# EAGLE design bbhTiny85 (EAGLE 6.4)
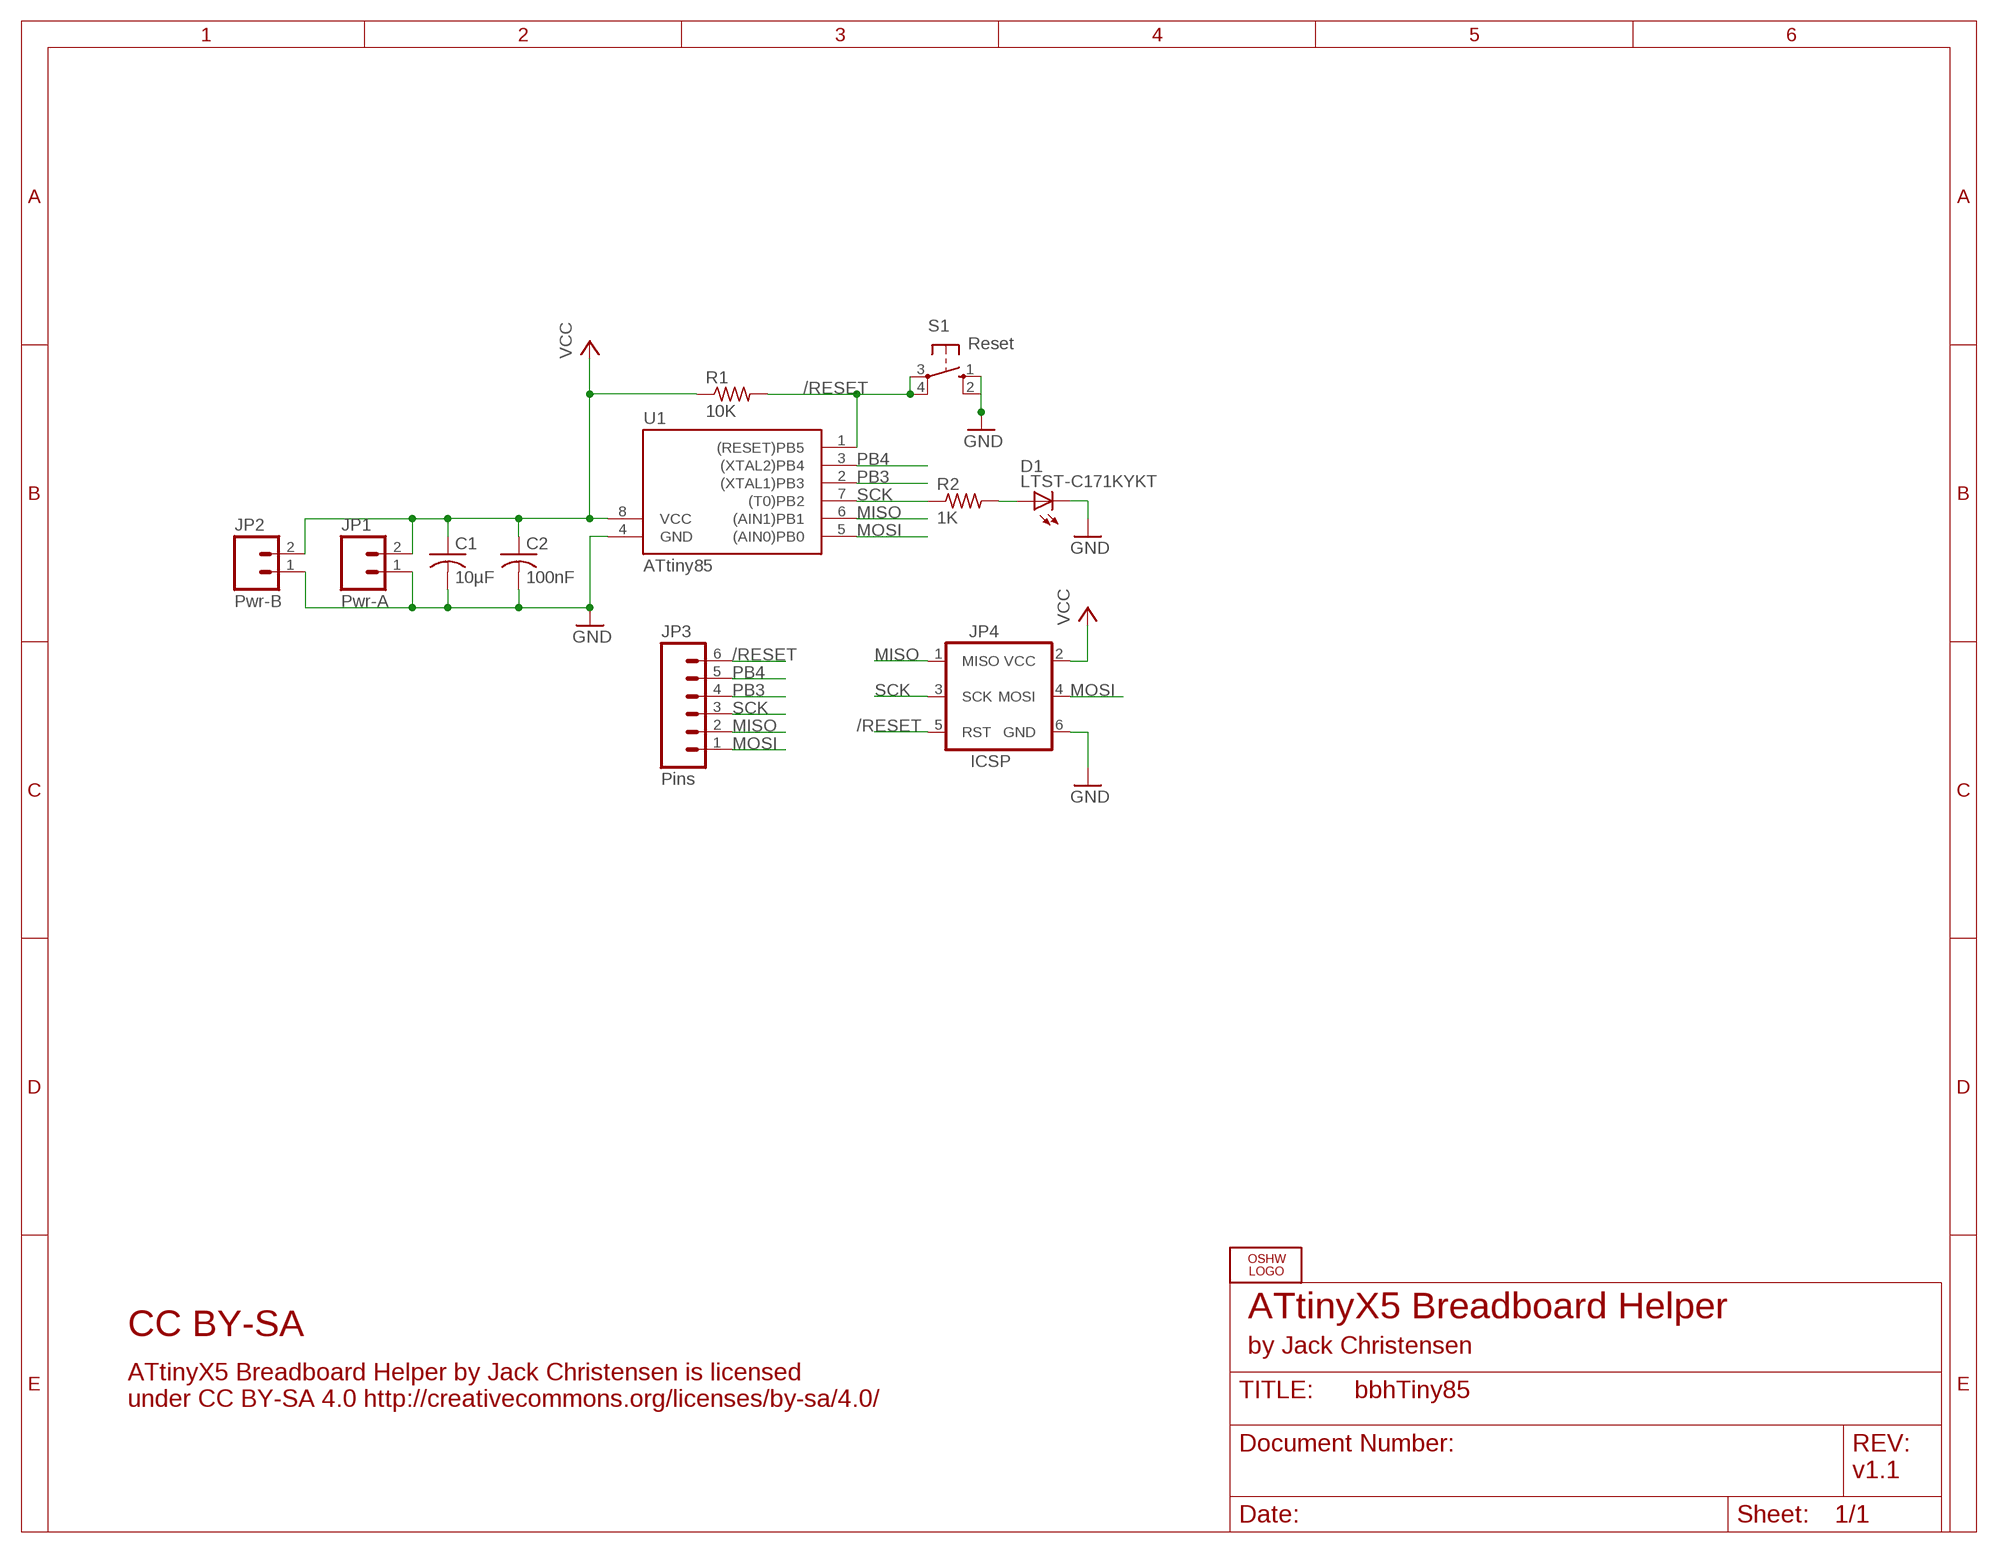
[diagram p0: schematic, sheet 1]

## Parts
C1  10µF  C-USM0805  [M0805]
C2  100nF  C-USM0805  [M0805]
D1  LTST-C171KYKT  LEDD0805A  [D0805A]
JP1  Pwr-A  M02PTH  [1X02]
JP2  Pwr-B  M02PTH  [1X02]
JP3  Pins  M06SIP  [1X06]
JP4  ICSP  AVR_SPI_PRG_62X3_LOCK  [2X3_LOCK]
LOGO1  OSHW_LOGO_8MILX0100-NT  [OSHW_8X100_NOTEXT]
R1  10K  R-US_M0805  [M0805]
R2  1K  R-US_M0805  [M0805]
S1  Reset  10-XXOCT  [B3F-10XXOCT]
U1  ATtiny85  TINY10P  [DIL08]

## Nets
/RESET: JP3.6 JP4.5(RST) R1.2 S1.3(P) S1.4(P1) U1.1((RESET)PB5)
GND: C1.2 C2.2 D1.K(C) JP1.1 JP2.1 JP4.6(GND) S1.1(S) S1.2(S1) U1.4(GND)
MISO: JP3.2 JP4.1(MISO) U1.6((AIN1)PB1)
MOSI: JP3.1 JP4.4(MOSI) U1.5((AIN0)PB0)
N$1: D1.A R2.2
PB3: JP3.4 U1.2((XTAL1)PB3)
PB4: JP3.5 U1.3((XTAL2)PB4)
SCK: JP3.3 JP4.3(SCK) R2.1 U1.7((T0)PB2)
VCC: C1.1 C2.1 JP1.2 JP2.2 JP4.2(VCC) R1.1 U1.8(VCC)

## Notes on the sheet
- ATtinyX5 Breadboard Helper
- CC BY-SA
- by Jack Christensen
- ATtinyX5 Breadboard Helper by Jack Christensen is licensed
  under CC BY-SA 4.0 http://creativecommons.org/licenses/by-sa/4.0/
- v1.1

## Library data of the parts
C1 C2 = _jc:C-US: CAPACITOR, American symbol
D1 = _jc:LED: LED OSRAM: - CHIPLED LG R971, LG N971, LY N971, LG Q971, LY Q971, LO R971, LY R971 LH N974, LH R974 LS Q976, LO Q976, LY Q976 LO Q996 - Hyper CHIPLED LW Q18S LB Q993, LB Q99A, LB R99A - SideLED LS A670, LO A670, LY A670, LG A670, LP A670 LB A673, LV A673, LT A673, LW A673 LH A674 LY A675 LS A676, LA A676, LO A676, LY A676, LW A676 LS A679, LY A679, LG A679 - Hyper Micro SIDELED® LS Y876, LA Y876, LO Y876, LY Y876 LT Y87S - SmartLED LW L88C, LW L88S LB L89C, LB L89S, LG L890 LS L89K, LO L89K, LY L89K LS L896, LA L896, LO L896, LY L896 - TOPLED LS T670, LO T670, LY T670, LG T670, LP T670 LSG T670, LSP T670, LSY T670, LOP T670, LYG T670 LG T671, LOG T671, LSG T671 LB T673, LV T673, LT T673, LW T673 LH T674 LS T676, LA T676, LO T676, LY T676, LB T676, LH T676, LSB T676, LW T676 LB T67C, LV T67C, LT T67C, LS T67K, LO T67K, LY T67K, LW E67C LS E67B, LA E67B, LO E67B, LY E67B, LB E67C, LV E67C, LT E67C LW T67C LS T679, LY T679, LG T679 LS T770, LO T770, LY T770, LG T770, LP T770 LB T773, LV T773, LT T773, LW T773 LH T774 LS E675, LA E675, LY E675, LS T675 LS T776, LA T776, LO T776, LY T776, LB T776 LHGB T686 LT T68C, LB T68C - Hyper Mini TOPLED® LB M676 - Mini TOPLED Santana® LG M470 LS M47K, LO M47K, LY M47K Source: http://www.osram.convergy.de/
JP1 JP2 = SparkFun:M02: Header 2 Standard 2-pin 0.1" header. Use with straight break away headers (SKU : PRT-00116), right angle break away headers (PRT-00553), swiss pins (PRT-00743), machine pins (PRT-00117), and female headers (PRT-00115). Molex polarized connector foot print use with SKU : PRT-08233 with associated crimp pins and housings.
JP3 = SparkFun:M06: Header 6 Standard 6-pin 0.1" header. Use with straight break away headers (SKU : PRT-00116), right angle break away headers (PRT-00553), swiss pins (PRT-00743), machine pins (PRT-00117), and female headers (PRT-00115). Molex polarized connector foot print use with SKU : PRT-08094 with associated crimp pins and housings. NOTES ON THE VARIANTS LOCK and LOCK_LONGPADS... This footprint was designed to help hold the alignment of a through-hole component (i.e. 6-pin header) while soldering it into place. You may notice that each hole has been shifted either up or down by 0.005 of an inch from it's more standard position (which is a perfectly straight line). This slight alteration caused the pins (the squares in the middle) to touch the edges of the holes. Because they are alternating, it causes a "brace" to hold the component in place. 0.005 has proven to be the perfect amount of "off-center" position when using our standard breakaway headers. Although looks a little odd when you look at the bare footprint, once you have a header in there, the alteration is very hard to notice. Also, if you push a header all the way into place, it is covered up entirely on the bottom side. This idea of altering the position of holes to aid alignment will be further integrated into the Sparkfun Library for other footprints. It can help hold any component with 3 or more connection pins.
JP4 = _jc:AVR_SPI_PRG_6: AVR ISP 6 Pin This is the reduced ISP connector for AVR programming. Common on Arduino. This footprint will take up less PCB space and can be used with a 10-pin to 6-pin adapter such as SKU: BOB-08508
LOGO1 = ohw-logo:OSHW_LOGO_8MIL
R1 R2 = _jc:R-US_: RESISTOR, American symbol
S1 = _jc:10-XX: OMRON SWITCH
U1 = atmel:TINY10: MICROCONTROLLER 1 Kbytes ROM; OC_FARNELL: unknown; OC_NEWARK: unknown

## Board
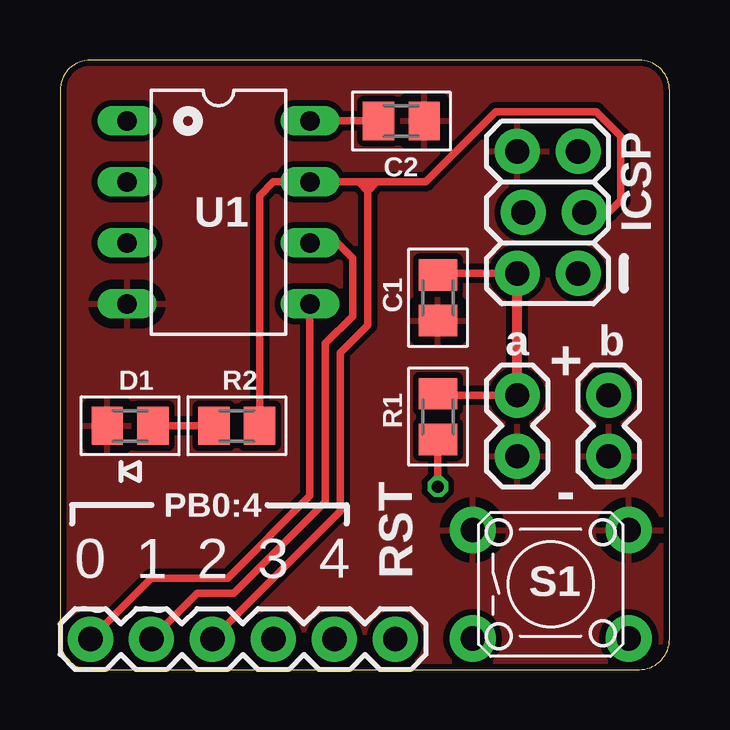
[diagram p1: board, top side]
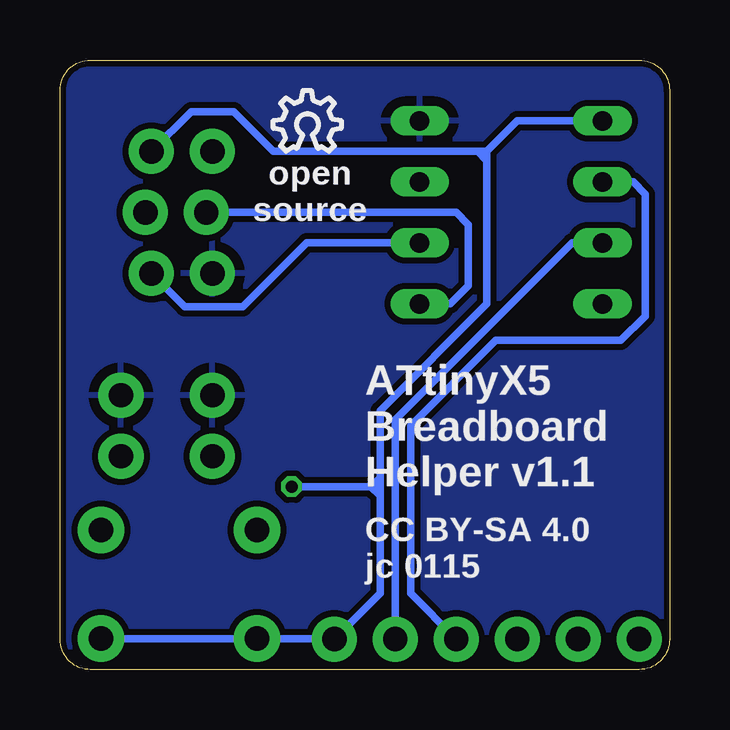
[diagram p2: board, bottom side, seen from below]

Size 25.4 x 25.4 mm. Coordinates in mm from the lower left corner, seen from the top.
Outline: 0,24.13 0,1.27 arc90 1.27,0 24.13,0 arc90 25.4,1.27 25.4,24.13 arc90 24.13,25.4 1.27,25.4 arc90 0,24.13
Copper layers (1*16): Top 0.0356mm / dielectric 1.5011mm / Bottom 0.0356mm
Design rules "LaenPCBOrder_jc1 *": minimum track width 8mil, minimum drill 13mil, track to track 8mil, track to pad 8mil, pad to pad 8mil, via to via 8mil, smd to smd 6mil, copper to edge 10mil, drill to drill 6mil, minimum pad ring 7mil, minimum via ring 7mil, stop-mask expansion 4mil, vias tented up to drill 20mil, thermal gap 16mil

### Footprints (pad centres in the part's own frame; a part is rotated, then mirrored left to right if it is on the bottom)
M0805 = smd 1.3 x 1.6: 1 -0.95,0; 2 0.95,0
D0805A = smd 1.3 x 1.6: A -0.95,0; K 0.95,0
1X02 = drill 1.016 pad 1.88: 1 0,0; 2 2.54,0
1X06 = drill 1.016 pad 1.88: 1 0,0; 2 2.54,0; 3 5.08,0; 4 7.62,0; 5 10.16,0; 6 12.7,0
2X3_LOCK = drill 1.016 pad 1.88: 1 0,0; 2 0,2.54; 3 2.54,-0.254; 4 2.54,2.286; 5 5.08,0; 6 5.08,2.54
B3F-10XXOCT = drill 1.016 pad 1.93: 1 -3.251,2.261; 2 3.251,2.261; 3 -3.251,-2.261; 4 3.251,-2.261
DIL08 = drill 0.813 long: 1 -3.81,-3.81; 2 -1.27,-3.81; 3 1.27,-3.81; 4 3.81,-3.81; 5 3.81,3.81; 6 1.27,3.81; 7 -1.27,3.81; 8 -3.81,3.81

### Placement (x,y rotation side)
C1  15.75,15.49 270 top
C2  14.22,22.86 0 top
D1  2.92,10.16 180 top
JP1  19.05,8.89 90 top
JP2  22.86,8.89 90 top
JP3  1.27,1.27 0 top
JP4  21.59,16.51 90 top
LOGO1  16.51,21.59 0 bottom
R1  15.75,10.54 270 top
R2  7.37,10.16 180 top
S1  20.45,3.56 0 top
U1  6.6,19.05 270 top

### Tracks (layer width: path | path; a pad name or v marks a point on that pad's centre or on a via)
/RESET  (via drill 0.5)
  Top 0.305: R1.2 v15.75,7.62
  Bottom 0.305: 8,21.59 16.51,21.59 18.16,23.24 19.94,23.24 JP4.5 | 8,21.59 7.62,21.59 | 7.62,21.59 7.62,21.21 | 7.62,21.21 7.62,15.24 12.06,10.79 12.06,8 | S1.4 S1.3 13.99,1.29 JP3.6 12.06,3.17 12.06,7.24 | 12.06,8 12.06,7.62 | 12.06,7.62 12.06,7.24 | v15.75,7.62 12.45,7.62 | 12.45,7.62 12.06,7.62 | U1.1 6.35,22.86 7.62,21.59 | 8,21.59 7.62,21.21 | 12.06,8 12.45,7.62 | 12.45,7.62 12.06,7.24
GND
  pour Top (isolate 0.254): -2.54,27.94 27.94,27.94 27.94,-2.54 -2.54,-2.54
MISO
  Top 0.305: JP3.2 5.71,3.17 7.24,3.17 11.05,6.99 11.05,13.59 12.19,14.73 12.19,17.14 11.56,17.78 U1.6
  Bottom 0.305: U1.6 15.11,17.78 17.78,15.11 20.19,15.11 JP4.1
MOSI
  Top 0.305: JP3.1 3.81,3.81 6.99,3.81 10.41,7.24 U1.5
  Bottom 0.305: JP4.4 8.89,19.05 8.38,18.54 8.38,16 9.14,15.24 U1.5
N$1
  Top 0.305: R2.2 D1.A
PB3
  Bottom 0.305: U1.2 1.52,20.32 1.02,19.81 1.02,14.73 2.03,13.72 7.24,13.72 10.79,10.16 10.79,3.17 JP3.4
PB4
  Bottom 0.305: U1.3 4.06,17.78 11.43,10.41 JP3.5
SCK
  Top 0.305: JP4.3 22.86,19.05 23.37,19.56 23.37,22.23 22.35,23.24 18.16,23.24 15.24,20.32 13.21,20.32 | 13.21,20.32 12.7,20.32 | 12.7,20.32 12.45,20.32 | 12.45,20.32 U1.7 8.89,20.32 8.32,19.75 R2.1 | JP3.3 11.68,6.6 11.68,13.21 12.83,14.35 12.83,19.94 | 12.83,19.94 12.83,20.19 12.7,20.32 | 12.45,20.32 12.83,19.94 | 12.83,19.94 13.21,20.32
VCC
  Top 0.305: U1.8 C2.1 | C1.1 15.56,16.51 JP4.2 | JP1.2 15.55,11.43 R1.1
  Top 0.406: JP1.2 JP4.2
  pour Bottom (isolate 0.254): -1.27,26.67 26.67,26.67 26.67,-1.27 -1.27,-1.27

### Text on the board
tPlace: ICSP | a | b | + | - | PB0:4 | 0 | 1 | 2 | 3 | 4 | RST | ~ | ~
bPlace: open / source | ATtinyX5 / Breadboard / Helper v1.1 | CC BY-SA 4.0 / jc 0115